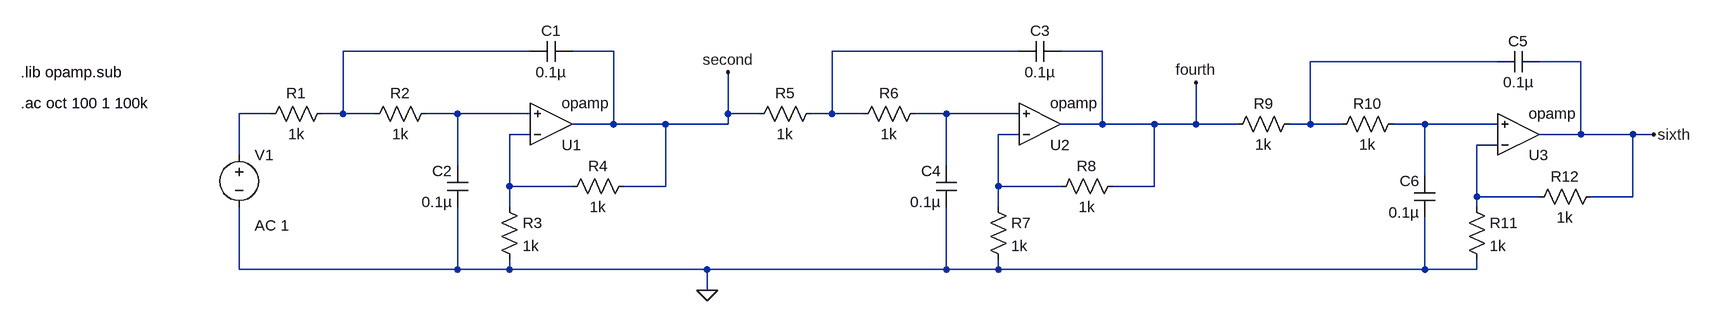
[diagram p0: schematic ACSweep_Filter_ButterworthBandpass.asc]
ACSweep_Filter_ButterworthBandpass.asc, the LTspice schematic file:
Version 4
SHEET 1 2012 680
WIRE 208 -112 -80 -112
WIRE 336 -112 272 -112
WIRE 960 -112 672 -112
WIRE 1088 -112 1024 -112
WIRE 1696 -96 1408 -96
WIRE 1824 -96 1760 -96
WIRE -192 -16 -240 -16
WIRE -80 -16 -80 -112
WIRE -80 -16 -112 -16
WIRE -32 -16 -80 -16
WIRE 96 -16 48 -16
WIRE 208 -16 96 -16
WIRE 512 -16 512 -80
WIRE 560 -16 512 -16
WIRE 672 -16 672 -112
WIRE 672 -16 640 -16
WIRE 720 -16 672 -16
WIRE 848 -16 800 -16
WIRE 960 -16 848 -16
WIRE 336 0 336 -112
WIRE 336 0 272 0
WIRE 416 0 336 0
WIRE 512 0 512 -16
WIRE 512 0 416 0
WIRE 1088 0 1088 -112
WIRE 1088 0 1024 0
WIRE 1168 0 1088 0
WIRE 1232 0 1232 -64
WIRE 1232 0 1168 0
WIRE 1296 0 1232 0
WIRE 1408 0 1408 -96
WIRE 1408 0 1376 0
WIRE 1456 0 1408 0
WIRE 1584 0 1536 0
WIRE 1696 0 1584 0
WIRE 208 16 176 16
WIRE 960 16 928 16
WIRE 1824 16 1824 -96
WIRE 1824 16 1760 16
WIRE 1904 16 1824 16
WIRE 1936 16 1904 16
WIRE 1696 32 1664 32
WIRE -240 48 -240 -16
WIRE 96 64 96 -16
WIRE 848 64 848 -16
WIRE 1584 80 1584 0
WIRE 176 96 176 16
WIRE 272 96 176 96
WIRE 416 96 416 0
WIRE 416 96 352 96
WIRE 928 96 928 16
WIRE 1024 96 928 96
WIRE 1168 96 1168 0
WIRE 1168 96 1104 96
WIRE 1664 112 1664 32
WIRE 1760 112 1664 112
WIRE 1904 112 1904 16
WIRE 1904 112 1840 112
WIRE 176 128 176 96
WIRE 928 128 928 96
WIRE 1664 128 1664 112
WIRE -240 224 -240 128
WIRE 96 224 96 128
WIRE 96 224 -240 224
WIRE 176 224 176 208
WIRE 176 224 96 224
WIRE 480 224 176 224
WIRE 848 224 848 128
WIRE 848 224 480 224
WIRE 928 224 928 208
WIRE 928 224 848 224
WIRE 1584 224 1584 144
WIRE 1584 224 928 224
WIRE 1664 224 1664 208
WIRE 1664 224 1584 224
WIRE 480 256 480 224
FLAG 480 256 0
FLAG 512 -80 second
FLAG 1232 -64 fourth
FLAG 1936 16 sixth
SYMBOL res -96 -32 R90
WINDOW 0 0 56 VBottom 2
WINDOW 3 32 56 VTop 2
SYMATTR InstName R1
SYMATTR Value 1k
SYMBOL res 64 -32 R90
WINDOW 0 0 56 VBottom 2
WINDOW 3 32 56 VTop 2
SYMATTR InstName R2
SYMATTR Value 1k
SYMBOL cap 272 -128 R90
WINDOW 0 0 32 VBottom 2
WINDOW 3 32 32 VTop 2
SYMATTR InstName C1
SYMATTR Value 0.1µ
SYMBOL cap 112 128 R180
WINDOW 0 24 56 Left 2
WINDOW 3 24 8 Left 2
SYMATTR InstName C2
SYMATTR Value 0.1µ
SYMBOL res 160 112 R0
SYMATTR InstName R3
SYMATTR Value 1k
SYMBOL res 368 80 R90
WINDOW 0 0 56 VBottom 2
WINDOW 3 32 56 VTop 2
SYMATTR InstName R4
SYMATTR Value 1k
SYMBOL OpAmps\\opamp 240 64 M180
SYMATTR InstName U1
SYMBOL voltage -240 32 R0
WINDOW 123 24 124 Left 2
WINDOW 39 0 0 Left 0
SYMATTR Value2 AC 1
SYMATTR InstName V1
SYMATTR Value ""
SYMBOL res 656 -32 R90
WINDOW 0 0 56 VBottom 2
WINDOW 3 32 56 VTop 2
SYMATTR InstName R5
SYMATTR Value 1k
SYMBOL res 816 -32 R90
WINDOW 0 0 56 VBottom 2
WINDOW 3 32 56 VTop 2
SYMATTR InstName R6
SYMATTR Value 1k
SYMBOL cap 1024 -128 R90
WINDOW 0 0 32 VBottom 2
WINDOW 3 32 32 VTop 2
SYMATTR InstName C3
SYMATTR Value 0.1µ
SYMBOL cap 864 128 R180
WINDOW 0 24 56 Left 2
WINDOW 3 24 8 Left 2
SYMATTR InstName C4
SYMATTR Value 0.1µ
SYMBOL res 912 112 R0
SYMATTR InstName R7
SYMATTR Value 1k
SYMBOL res 1120 80 R90
WINDOW 0 0 56 VBottom 2
WINDOW 3 32 56 VTop 2
SYMATTR InstName R8
SYMATTR Value 1k
SYMBOL OpAmps\\opamp 992 64 M180
SYMATTR InstName U2
SYMBOL res 1392 -16 R90
WINDOW 0 0 56 VBottom 2
WINDOW 3 32 56 VTop 2
SYMATTR InstName R9
SYMATTR Value 1k
SYMBOL res 1552 -16 R90
WINDOW 0 0 56 VBottom 2
WINDOW 3 32 56 VTop 2
SYMATTR InstName R10
SYMATTR Value 1k
SYMBOL cap 1760 -112 R90
WINDOW 0 0 32 VBottom 2
WINDOW 3 32 32 VTop 2
SYMATTR InstName C5
SYMATTR Value 0.1µ
SYMBOL cap 1600 144 R180
WINDOW 0 24 56 Left 2
WINDOW 3 24 8 Left 2
SYMATTR InstName C6
SYMATTR Value 0.1µ
SYMBOL res 1648 112 R0
SYMATTR InstName R11
SYMATTR Value 1k
SYMBOL res 1856 96 R90
WINDOW 0 0 56 VBottom 2
WINDOW 3 32 56 VTop 2
SYMATTR InstName R12
SYMATTR Value 1k
SYMBOL OpAmps\\opamp 1728 80 M180
SYMATTR InstName U3
TEXT -576 -32 Left 2 !.ac oct 100 1 100k
TEXT -576 -80 Left 2 !.lib opamp.sub

The netlist it stands for:
* ACSweep_Filter_ButterworthBandpass.asc
R1 N001 N004 1k
R2 N005 N001 1k
C1 second N001 0.1µ
C2 0 N005 0.1µ
R3 N008 0 1k
R4 second N008 1k
XU1 N008 N005 second opamp Aol=100K GBW=10Meg  ; pins invin noninvin out
V1 N004 0 AC 1
R5 N002 second 1k
R6 N006 N002 1k
C3 fourth N002 0.1µ
C4 0 N006 0.1µ
R7 N009 0 1k
R8 fourth N009 1k
XU2 N009 N006 fourth opamp Aol=100K GBW=10Meg  ; pins invin noninvin out
R9 N003 fourth 1k
R10 N007 N003 1k
C5 sixth N003 0.1µ
C6 0 N007 0.1µ
R11 N010 0 1k
R12 sixth N010 1k
XU3 N010 N007 sixth opamp Aol=100K GBW=10Meg  ; pins invin noninvin out
.ac oct 100 1 100k
.lib opamp.sub
.backanno
.end